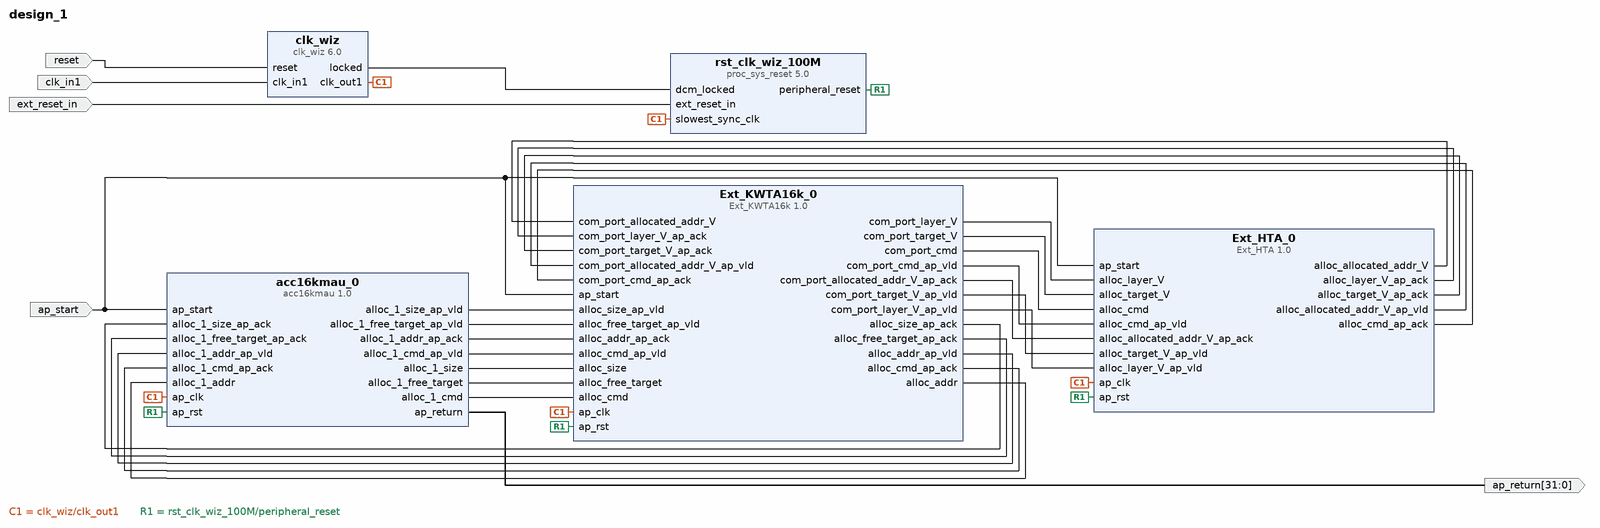
[diagram p0: block diagram of the top level]
# Vivado block design design_1, xc7z020clg484-1, Vivado 2018.2
create_bd_design design_1

create_bd_port -dir I -type rst reset
set_property -dict {CONFIG.POLARITY ACTIVE_HIGH} [get_bd_ports reset]
create_bd_port -dir I -type clk clk_in1
create_bd_port -dir I -type rst ext_reset_in
create_bd_port -dir I ap_start
create_bd_port -dir O -from 31 -to 0 -type data ap_return

create_bd_cell -type ip -vlnv xilinx.com:hls:Ext_HTA:1.0 Ext_HTA_0
create_bd_cell -type ip -vlnv xilinx.com:hls:Ext_KWTA16k:1.0 Ext_KWTA16k_0
create_bd_cell -type ip -vlnv xilinx.com:hls:acc16kmau:1.0 acc16kmau_0
create_bd_cell -type ip -vlnv xilinx.com:ip:clk_wiz:6.0 clk_wiz
create_bd_cell -type ip -vlnv xilinx.com:ip:proc_sys_reset:5.0 rst_clk_wiz_100M

# ---- connections ----

connect_bd_net [get_bd_pins clk_wiz/clk_out1] \
  [get_bd_pins Ext_HTA_0/ap_clk] [get_bd_pins Ext_KWTA16k_0/ap_clk] [get_bd_pins acc16kmau_0/ap_clk] \
  [get_bd_pins rst_clk_wiz_100M/slowest_sync_clk]
connect_bd_net [get_bd_pins clk_wiz/locked] [get_bd_pins rst_clk_wiz_100M/dcm_locked]
connect_bd_net [get_bd_pins rst_clk_wiz_100M/peripheral_reset] \
  [get_bd_pins Ext_HTA_0/ap_rst] [get_bd_pins Ext_KWTA16k_0/ap_rst] [get_bd_pins acc16kmau_0/ap_rst]
connect_bd_net [get_bd_ports reset] [get_bd_pins clk_wiz/reset]
connect_bd_net -net clk_in1_1 [get_bd_ports clk_in1] [get_bd_pins clk_wiz/clk_in1]
connect_bd_net [get_bd_ports ext_reset_in] [get_bd_pins rst_clk_wiz_100M/ext_reset_in]
connect_bd_net [get_bd_ports ap_start] [get_bd_pins Ext_HTA_0/ap_start] [get_bd_pins Ext_KWTA16k_0/ap_start] [get_bd_pins acc16kmau_0/ap_start]
connect_bd_net [get_bd_pins Ext_HTA_0/alloc_allocated_addr_V] [get_bd_pins Ext_KWTA16k_0/com_port_allocated_addr_V]
connect_bd_net [get_bd_pins Ext_KWTA16k_0/com_port_layer_V] [get_bd_pins Ext_HTA_0/alloc_layer_V]
connect_bd_net [get_bd_pins Ext_KWTA16k_0/com_port_target_V] [get_bd_pins Ext_HTA_0/alloc_target_V]
connect_bd_net [get_bd_pins Ext_KWTA16k_0/com_port_cmd] [get_bd_pins Ext_HTA_0/alloc_cmd]
connect_bd_net [get_bd_pins Ext_KWTA16k_0/com_port_cmd_ap_vld] [get_bd_pins Ext_HTA_0/alloc_cmd_ap_vld]
connect_bd_net [get_bd_pins Ext_KWTA16k_0/com_port_allocated_addr_V_ap_ack] [get_bd_pins Ext_HTA_0/alloc_allocated_addr_V_ap_ack]
connect_bd_net [get_bd_pins Ext_KWTA16k_0/com_port_target_V_ap_vld] [get_bd_pins Ext_HTA_0/alloc_target_V_ap_vld]
connect_bd_net [get_bd_pins Ext_KWTA16k_0/com_port_layer_V_ap_vld] [get_bd_pins Ext_HTA_0/alloc_layer_V_ap_vld]
connect_bd_net [get_bd_pins Ext_HTA_0/alloc_layer_V_ap_ack] [get_bd_pins Ext_KWTA16k_0/com_port_layer_V_ap_ack]
connect_bd_net [get_bd_pins Ext_HTA_0/alloc_target_V_ap_ack] [get_bd_pins Ext_KWTA16k_0/com_port_target_V_ap_ack]
connect_bd_net [get_bd_pins Ext_HTA_0/alloc_allocated_addr_V_ap_vld] [get_bd_pins Ext_KWTA16k_0/com_port_allocated_addr_V_ap_vld]
connect_bd_net [get_bd_pins Ext_HTA_0/alloc_cmd_ap_ack] [get_bd_pins Ext_KWTA16k_0/com_port_cmd_ap_ack]
connect_bd_net [get_bd_pins Ext_KWTA16k_0/alloc_size_ap_ack] [get_bd_pins acc16kmau_0/alloc_1_size_ap_ack]
connect_bd_net [get_bd_pins Ext_KWTA16k_0/alloc_free_target_ap_ack] [get_bd_pins acc16kmau_0/alloc_1_free_target_ap_ack]
connect_bd_net [get_bd_pins Ext_KWTA16k_0/alloc_addr_ap_vld] [get_bd_pins acc16kmau_0/alloc_1_addr_ap_vld]
connect_bd_net [get_bd_pins Ext_KWTA16k_0/alloc_cmd_ap_ack] [get_bd_pins acc16kmau_0/alloc_1_cmd_ap_ack]
connect_bd_net [get_bd_pins Ext_KWTA16k_0/alloc_addr] [get_bd_pins acc16kmau_0/alloc_1_addr]
connect_bd_net [get_bd_pins acc16kmau_0/alloc_1_size_ap_vld] [get_bd_pins Ext_KWTA16k_0/alloc_size_ap_vld]
connect_bd_net [get_bd_pins acc16kmau_0/alloc_1_free_target_ap_vld] [get_bd_pins Ext_KWTA16k_0/alloc_free_target_ap_vld]
connect_bd_net [get_bd_pins acc16kmau_0/alloc_1_addr_ap_ack] [get_bd_pins Ext_KWTA16k_0/alloc_addr_ap_ack]
connect_bd_net [get_bd_pins acc16kmau_0/alloc_1_cmd_ap_vld] [get_bd_pins Ext_KWTA16k_0/alloc_cmd_ap_vld]
connect_bd_net [get_bd_pins acc16kmau_0/ap_return] [get_bd_ports ap_return]
connect_bd_net [get_bd_pins acc16kmau_0/alloc_1_size] [get_bd_pins Ext_KWTA16k_0/alloc_size]
connect_bd_net [get_bd_pins acc16kmau_0/alloc_1_free_target] [get_bd_pins Ext_KWTA16k_0/alloc_free_target]
connect_bd_net [get_bd_pins acc16kmau_0/alloc_1_cmd] [get_bd_pins Ext_KWTA16k_0/alloc_cmd]

validate_bd_design
save_bd_design
